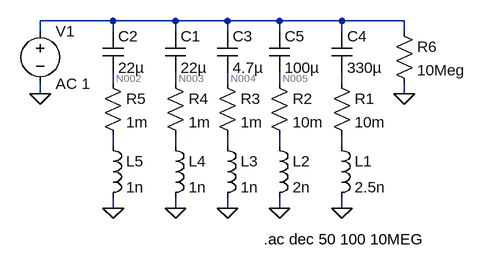
[diagram p0: schematic MultiCapModel.asc]
MultiCapModel.asc, the LTspice schematic file:
Version 4
SHEET 1 880 680
WIRE 16 96 -96 96
WIRE 112 96 16 96
WIRE 192 96 112 96
WIRE 272 96 192 96
WIRE 368 96 272 96
WIRE 464 96 368 96
WIRE -96 112 -96 96
WIRE 16 112 16 96
WIRE 112 112 112 96
WIRE 192 112 192 96
WIRE 272 112 272 96
WIRE 368 112 368 96
WIRE 464 112 464 96
WIRE 16 192 16 176
WIRE 112 192 112 176
WIRE 192 192 192 176
WIRE 272 192 272 176
WIRE 368 192 368 176
WIRE -96 208 -96 192
WIRE 464 208 464 192
WIRE 16 288 16 272
WIRE 112 288 112 272
WIRE 192 288 192 272
WIRE 272 288 272 272
WIRE 368 288 368 272
WIRE 16 384 16 368
WIRE 112 384 112 368
WIRE 192 384 192 368
WIRE 272 384 272 368
WIRE 368 384 368 368
FLAG 192 384 0
FLAG -96 208 0
FLAG 16 384 0
FLAG 112 384 0
FLAG 272 384 0
FLAG 368 384 0
FLAG 464 208 0
SYMBOL cap 96 112 R0
SYMATTR InstName C1
SYMATTR Value 22µ
SYMBOL cap 0 112 R0
SYMATTR InstName C2
SYMATTR Value 22µ
SYMBOL cap 176 112 R0
SYMATTR InstName C3
SYMATTR Value 4.7µ
SYMBOL cap 352 112 R0
SYMATTR InstName C4
SYMATTR Value 330µ
SYMBOL cap 256 112 R0
SYMATTR InstName C5
SYMATTR Value 100µ
SYMBOL res 352 176 R0
SYMATTR InstName R1
SYMATTR Value 10m
SYMBOL res 256 176 R0
SYMATTR InstName R2
SYMATTR Value 10m
SYMBOL res 176 176 R0
SYMATTR InstName R3
SYMATTR Value 1m
SYMBOL res 96 176 R0
SYMATTR InstName R4
SYMATTR Value 1m
SYMBOL res 0 176 R0
SYMATTR InstName R5
SYMATTR Value 1m
SYMBOL ind 352 272 R0
SYMATTR InstName L1
SYMATTR Value 2.5n
SYMBOL ind 256 272 R0
SYMATTR InstName L2
SYMATTR Value 2n
SYMBOL ind 176 272 R0
SYMATTR InstName L3
SYMATTR Value 1n
SYMBOL ind 96 272 R0
SYMATTR InstName L4
SYMATTR Value 1n
SYMBOL ind 0 272 R0
SYMATTR InstName L5
SYMATTR Value 1n
SYMBOL voltage -96 96 R0
WINDOW 123 24 97 Left 2
WINDOW 39 24 117 Left 2
SYMATTR Value2 AC 1
SYMATTR InstName V1
SYMATTR Value ""
SYMBOL res 448 96 R0
SYMATTR InstName R6
SYMATTR Value 10Meg
TEXT 248 432 Left 2 !.ac dec 50 100 10MEG

The netlist it stands for:
* MultiCapModel.asc
C1 N001 N003 22µ
C2 N001 N002 22µ
C3 N001 N004 4.7µ
C4 N001 N006 330µ
C5 N001 N005 100µ
R1 N006 N011 10m
R2 N005 N010 10m
R3 N004 N009 1m
R4 N003 N008 1m
R5 N002 N007 1m
L1 N011 0 2.5n
L2 N010 0 2n
L3 N009 0 1n
L4 N008 0 1n
L5 N007 0 1n
V1 N001 0 AC 1
R6 N001 0 10Meg
.ac dec 50 100 10MEG
.backanno
.end

* Results of the author's LTspice run, read from the files saved beside the schematic
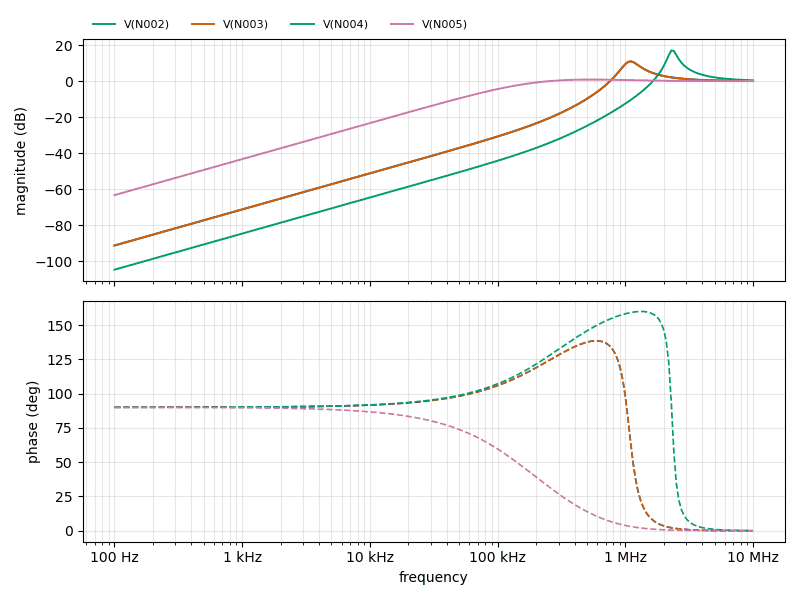
[diagram p1: AC Analysis of MultiCapModel.asc, plotted from the saved traces]
* AC Analysis, 1 run:
*   V(N002): -91.17 dB at 100 Hz, 0.10 dB at 10 MHz, peak 11.00 dB at 1.096 MHz, 3 dB below the peak at 957.4 kHz and 1.312 MHz
*   V(N003): -91.17 dB at 100 Hz, 0.10 dB at 10 MHz, peak 11.00 dB at 1.096 MHz, 3 dB below the peak at 957.4 kHz and 1.312 MHz
*   V(N004): -104.57 dB at 100 Hz, 0.48 dB at 10 MHz, peak 17.07 dB at 2.291 MHz, 3 dB below the peak at 2.177 MHz and 2.527 MHz
*   V(N005): -63.21 dB at 100 Hz, 0.01 dB at 10 MHz, peak 0.90 dB at 549.5 kHz, 3 dB below the peak at 146.7 kHz